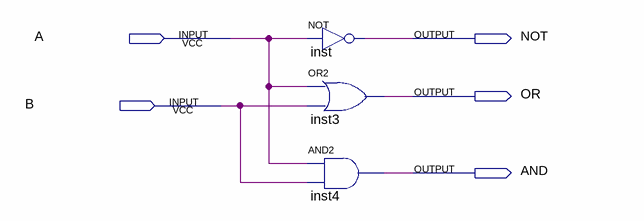
[diagram p0: schematic sheet]
// Quartus schematic Test.bdf as structural Verilog: 3 symbols, 5 pins
module Test (
  input  A,
  input  B,
  output NOT,
  output OR,
  output AND
);

  not inst (NOT, A);
  or inst3 (OR, A, B);
  and inst4 (AND, A, B);
endmodule
